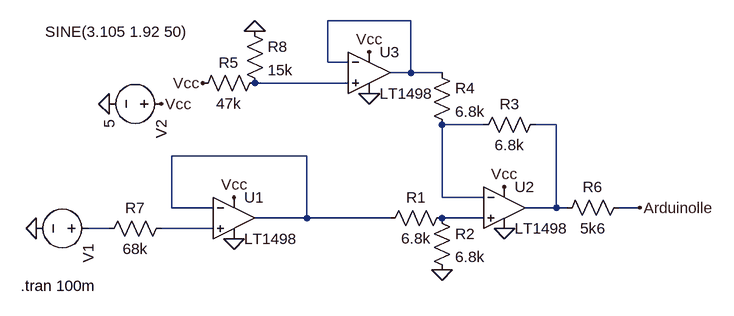
[diagram p0: schematic iot-projekti-wind-direction final.asc]
iot-projekti-wind-direction final.asc, the LTspice schematic file:
Version 4
SHEET 1 880 680
WIRE 288 -144 160 -144
WIRE 160 -80 160 -144
WIRE 192 -80 160 -80
WIRE 288 -64 288 -144
WIRE 288 -64 256 -64
WIRE 336 -64 288 -64
WIRE 192 -48 48 -48
WIRE 400 16 336 16
WIRE 512 16 480 16
WIRE 128 64 -80 64
WIRE 336 128 336 16
WIRE 400 128 336 128
WIRE -80 144 -80 64
WIRE -16 144 -80 144
WIRE 512 144 512 16
WIRE 512 144 464 144
WIRE 528 144 512 144
WIRE 640 144 608 144
WIRE 128 160 128 64
WIRE 128 160 48 160
WIRE 256 160 128 160
WIRE 400 160 336 160
WIRE -176 176 -208 176
WIRE -16 176 -96 176
FLAG -288 176 0
FLAG -176 -16 0
FLAG 16 192 0
FLAG -96 -16 Vcc
FLAG 16 128 Vcc
FLAG 432 176 0
FLAG 432 112 Vcc
FLAG 336 240 0
FLAG -32 -48 Vcc
FLAG 48 -128 0
FLAG 224 -32 0
FLAG 224 -96 Vcc
FLAG 640 144 Arduinolle
SYMBOL OpAmps\\LT1498 16 96 R0
SYMATTR InstName U1
SYMBOL voltage -192 176 R90
WINDOW 123 0 0 Left 0
WINDOW 39 0 0 Left 0
WINDOW 3 -303 -138 VRight 2
SYMATTR Value SINE(3.105 1.92 50)
SYMATTR InstName V1
SYMBOL voltage -80 -16 R90
WINDOW 123 0 0 Left 0
WINDOW 39 0 0 Left 0
SYMATTR InstName V2
SYMATTR Value 5
SYMBOL res 512 160 R270
WINDOW 0 32 56 VTop 2
WINDOW 3 0 56 VBottom 2
SYMATTR InstName R6
SYMATTR Value 5k6
SYMBOL res -192 192 R270
WINDOW 0 32 56 VTop 2
WINDOW 3 0 56 VBottom 2
SYMATTR InstName R7
SYMATTR Value 68k
SYMBOL OpAmps\\LT1498 432 80 R0
SYMATTR InstName U2
SYMBOL res 352 144 R90
WINDOW 0 0 56 VBottom 2
WINDOW 3 32 56 VTop 2
SYMATTR InstName R1
SYMATTR Value 6.8k
SYMBOL res 320 144 R0
SYMATTR InstName R2
SYMATTR Value 6.8k
SYMBOL res 496 0 R90
WINDOW 0 0 56 VBottom 2
WINDOW 3 32 56 VTop 2
SYMATTR InstName R3
SYMATTR Value 6.8k
SYMBOL res 320 -80 R0
SYMATTR InstName R4
SYMATTR Value 6.8k
SYMBOL res 64 -64 R90
WINDOW 0 0 56 VBottom 2
WINDOW 3 32 56 VTop 2
SYMATTR InstName R5
SYMATTR Value 47k
SYMBOL res 32 -144 R0
SYMATTR InstName R8
SYMATTR Value 15k
SYMBOL OpAmps\\LT1498 224 -128 R0
SYMATTR InstName U3
TEXT -312 264 Left 2 !.tran 100m

The netlist it stands for:
* iot-projekti-wind-direction final.asc
XU1 N008 N005 Vcc 0 N005 LT1498  ; pins In+ In- V+ V- OUT
V1 N007 0 SINE(3.105 1.92 50)
V2 Vcc 0 5
R6 N004 Arduinolle 5k6
R7 N007 N008 68k
XU2 N006 N003 Vcc 0 N004 LT1498  ; pins In+ In- V+ V- OUT
R1 N006 N005 6.8k
R2 N006 0 6.8k
R3 N004 N003 6.8k
R4 N001 N003 6.8k
R5 N002 Vcc 47k
R8 0 N002 15k
XU3 N002 N001 Vcc 0 N001 LT1498  ; pins In+ In- V+ V- OUT
.tran 100m
.lib LTC.lib
.backanno
.end